# EAGLE design CompIoT (EAGLE 7.4.0)
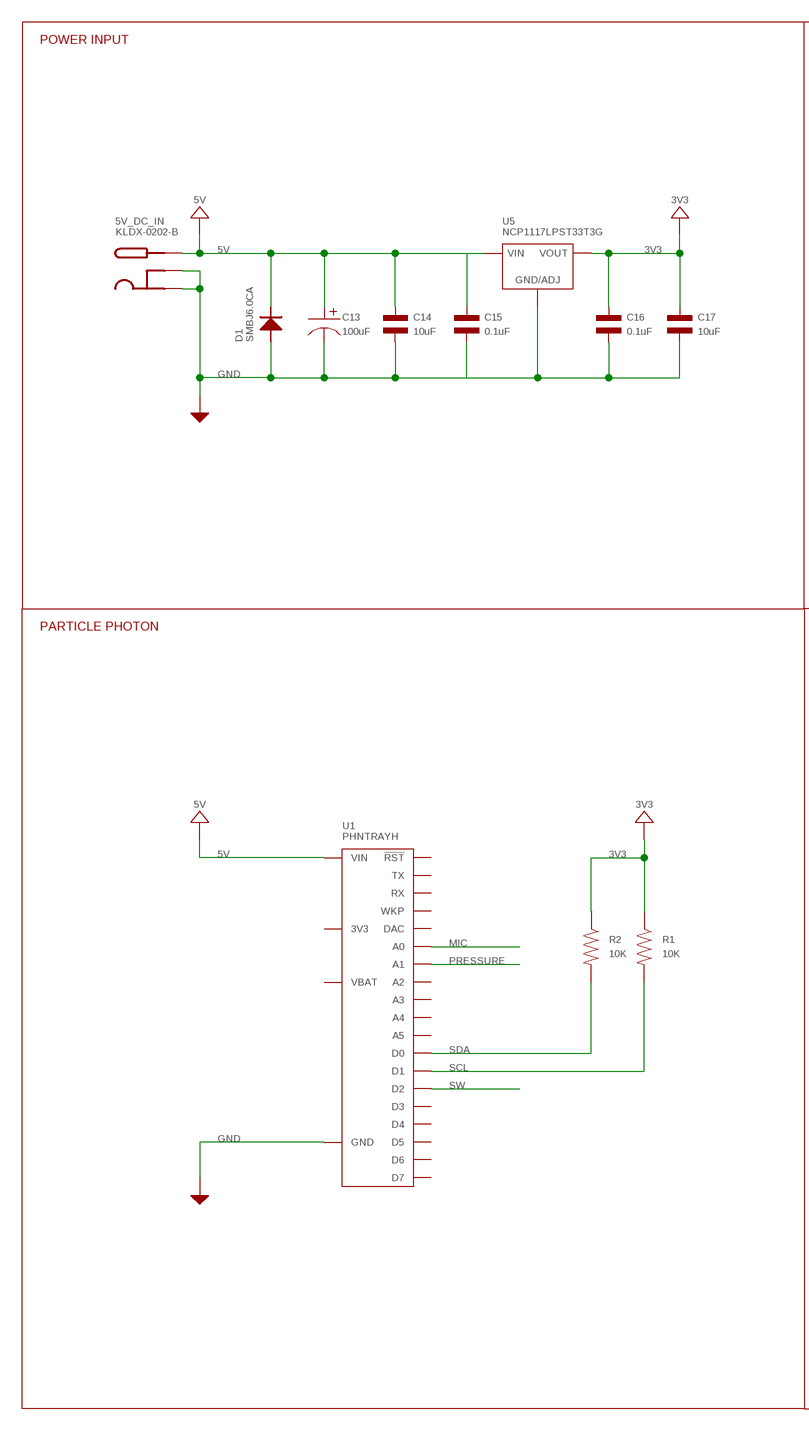
[diagram p0: schematic, sheet 1, part 1 of 2]
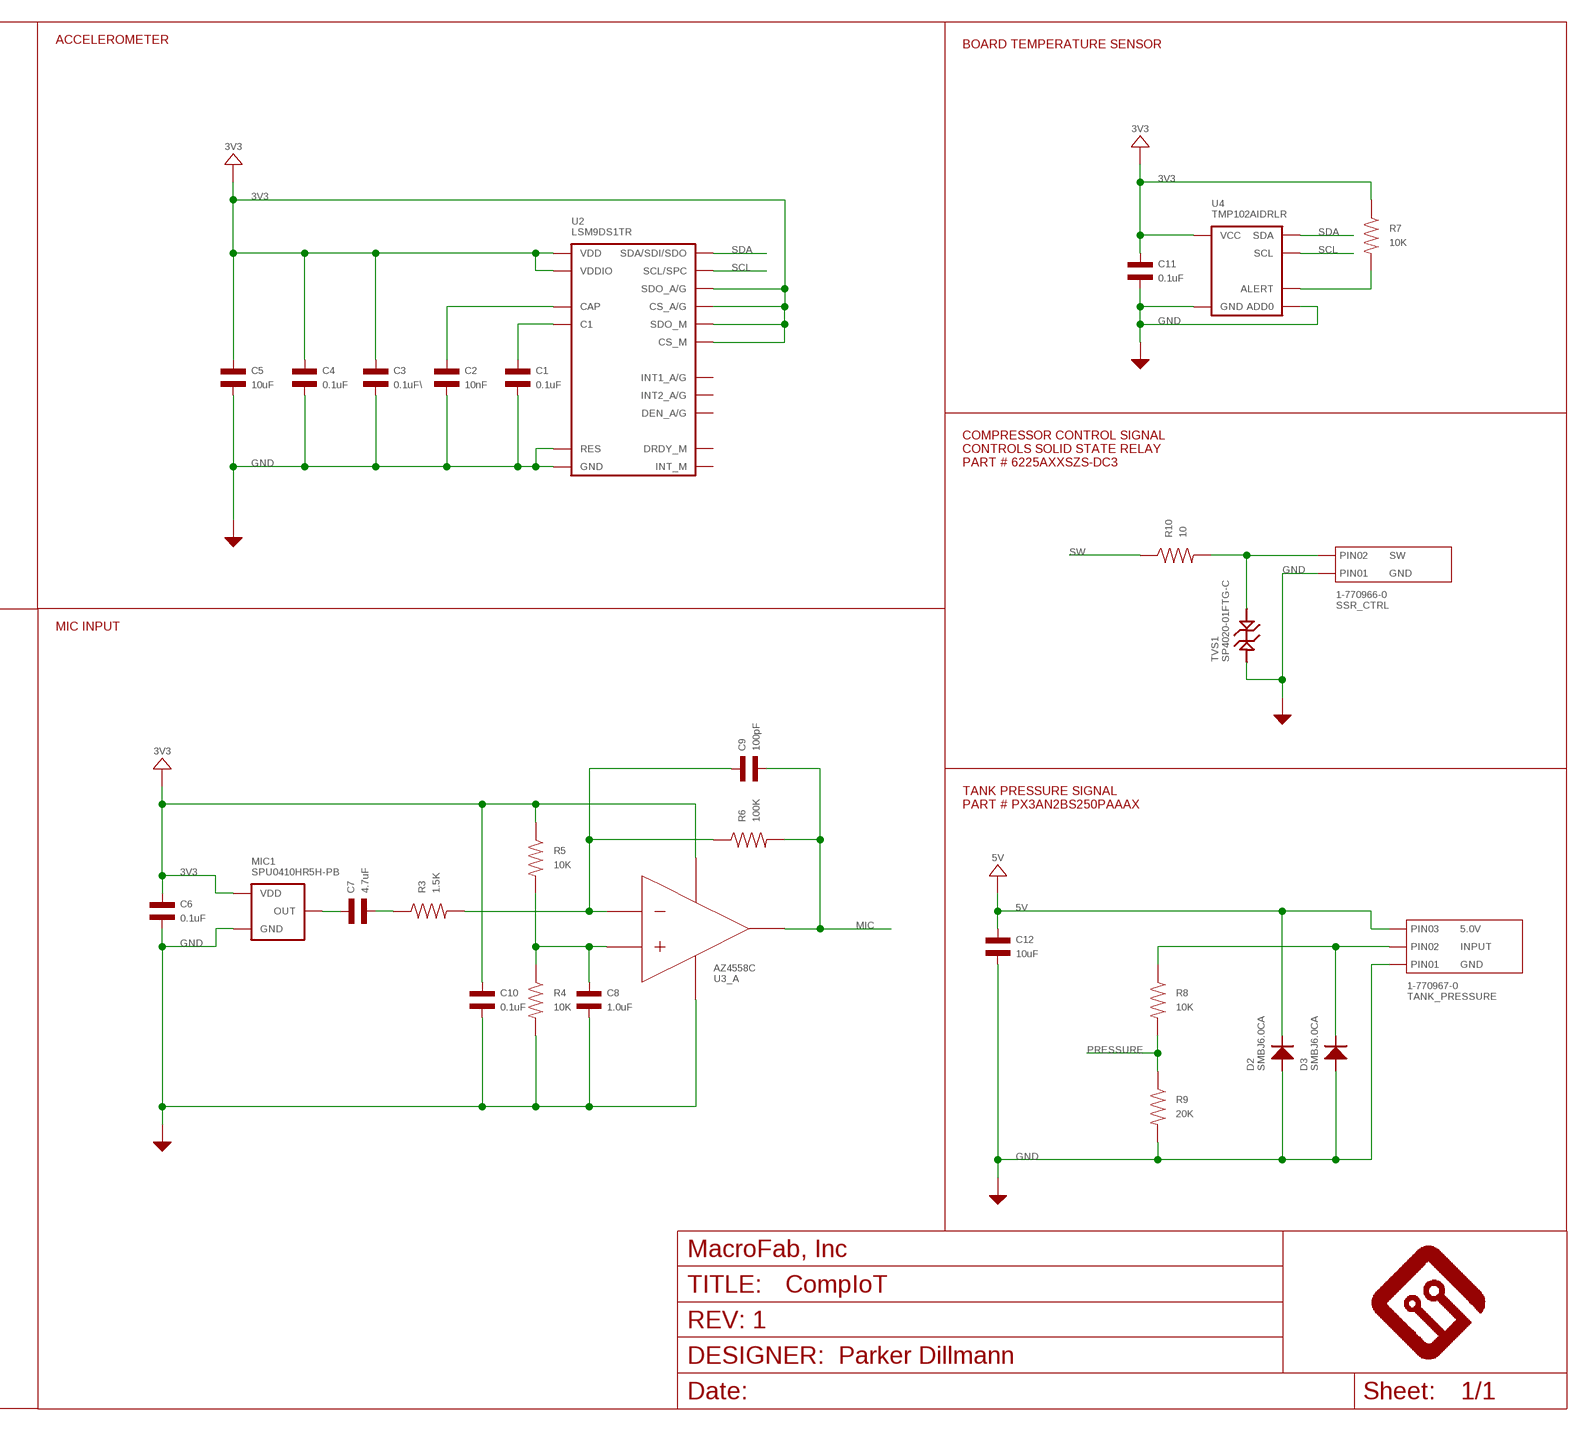
[diagram p1: schematic, sheet 1, part 2 of 2]

## Parts
5V_DC_IN  KLDX-0202-B  DC_PWR_JACK_2.5MM_RIGHT  [DC_PWR_JACK]
C1  0.1uF  CAPACITOR_NP_0603  [C0603]
C2  10nF  CAPACITOR_NP_0603  [C0603]
C3  0.1uF\  CAPACITOR_NP_0603  [C0603]
C4  0.1uF  CAPACITOR_NP_0603  [C0603]
C5  10uF  CAPACITOR_NP_1206  [C1206]
C6  0.1uF  CAPACITOR_NP_0603  [C0603]
C7  4.7uF  CAPACITOR_NP_1206  [C1206]
C8  1.0uF  CAPACITOR_NP_0603  [C0603]
C9  100pF  CAPACITOR_NP_0603  [C0603]
C10  0.1uF  CAPACITOR_NP_0603  [C0603]
C11  0.1uF  CAPACITOR_NP_0603  [C0603]
C12  10uF  CAPACITOR_NP_1206  [C1206]
C13  100uF  CAPACITOR_P_6.3MM  [CP6.3MM]
C14  10uF  CAPACITOR_NP_1206  [C1206]
C15  0.1uF  CAPACITOR_NP_0603  [C0603]
C16  0.1uF  CAPACITOR_NP_0603  [C0603]
C17  10uF  CAPACITOR_NP_1206  [C1206]
D1  SMBJ6.0CA  DIODE_SMBJ  [SMBJ]
D2  SMBJ6.0CA  DIODE_SMBJ  [SMBJ]
D3  SMBJ6.0CA  DIODE_SMBJ  [SMBJ]
FRAME1  MF_FRAMEDEFAULT  [MF_FRAME_DEFAULT]
MIC1  SPU0410HR5H-PB  [SPU0410HR5H-PB]
R1  10K  RESISTOR_0603  [R0603]
R2  10K  RESISTOR_0603  [R0603]
R3  1.5K  RESISTOR_0603  [R0603]
R4  10K  RESISTOR_0603  [R0603]
R5  10K  RESISTOR_0603  [R0603]
R6  100K  RESISTOR_0603  [R0603]
R7  10K  RESISTOR_0603  [R0603]
R8  10K  RESISTOR_0603  [R0603]
R9  20K  RESISTOR_0603  [R0603]
R10  10  RESISTOR_0603  [R0603]
SSR_CTRL  1-770966-0  CON_01X02_1-770966-0  [1-770966-0]
TANK_PRESSURE  1-770967-0  CON_01X03_1-770967-0  [1-770967-0]
TVS1  SP4020-01FTG-C  TVS_DIODE_SOD-323  [SOD-323]
U1  PHNTRAYH  PARTICLE_PHOTON_PTH  [PARTICLE_PHOTON_PTH]
U2  LSM9DS1TR  [LSM9DS1_LGA-24]
U3  AZ4558C  [AZ4558C_SOIC-8]
U4  TMP102AIDRLR  [TMP102_SOT-553-6]
U5  NCP1117LPST33T3G  [SOT-223-3]

## Nets
3V3: C3.P$1 C4.P$1 C5.P$1 C6.P$1 C10.P$1 C11.P$1 C16.P$1 C17.P$1 MIC1.P$1(VDD) R1.P$1 R2.P$1 R5.P$1 R7.P$1 U2.1(VDDIO) U2.3(VDDIO) U2.5(SDO_A/G) U2.6(SDO_M) U2.7(CS_A/G) U2.8(CS_M) U2.22(VDD) U2.23(VDD) U3.4(_A:VEE) U4.5(VCC) U5.P$1(VOUT) U5.P$3(VOUT)
5V: 5V_DC_IN.PIN C12.P$1 C13.P$1 C14.P$1 C15.P$1 D1.CATH(CATHODE) D2.CATH(CATHODE) TANK_PRESSURE.P$3(PIN3) U1.1(VIN) U5.P$4(VIN)
GND: 5V_DC_IN.SLEEVE1(SLEEVE) 5V_DC_IN.SLEEVE2(SLEEVE_SHUNT) C1.P$2 C2.P$2 C3.P$2 C4.P$2 C5.P$2 C6.P$2 C8.P$2 C10.P$2 C11.P$2 C12.P$2 C13.P$2 C14.P$2 C15.P$2 C16.P$2 C17.P$2 D1.ANODE D2.ANODE D3.ANODE MIC1.P$2(GND) MIC1.P$3(GND) R4.P$2 R9.P$2 SSR_CTRL.P$1(PIN1) TANK_PRESSURE.P$1(PIN1) TVS1.ANODE U1.2(GND) U1.21(GND) U2.14(RES) U2.15(RES) U2.16(RES) U2.17(RES) U2.18(RES) U2.19(GND) U2.20(GND) U3.8(_A:VCC) U4.2(GND) U4.4(ADD0) U5.P$2(GND/ADJ)
MIC: C9.P$2 R6.P$2 U1.12(A0) U3.1(_A:OUTPUT_1)
N$1: C1.P$1 U2.24(C1)
N$2: C2.P$1 U2.21(CAP)
N$3: C7.P$1 MIC1.P$4(OUT)
N$4: C7.P$2 R3.P$1
N$5: C9.P$1 R3.P$2 R6.P$1 U3.2(_A:INPUT_1-)
N$6: C8.P$1 R4.P$1 R5.P$2 U3.3(_A:INPUT_1+)
N$7: R7.P$2 U4.3(ALERT)
N$8: R10.P$2 SSR_CTRL.P$2(PIN2) TVS1.CATH
N$9: D3.CATH(CATHODE) R8.P$1 TANK_PRESSURE.P$2(PIN2)
PRESSURE: R8.P$2 R9.P$1 U1.11(A1)
SCL: R1.P$2 U1.14(D1) U2.2(SCL/SPC) U4.1(SCL)
SDA: R2.P$2 U1.13(D0) U2.4(SDA/SDI/SDO) U4.6(SDA)
SW: R10.P$1 U1.15(D2)
Unconnected: U1.3(TX) U1.4(RX) U1.5(WKP) U1.6(DAC) U1.7(A5) U1.8(A4) U1.9(A3) U1.10(A2) U1.16(D3) U1.17(D4) U1.18(D5) U1.19(D6) U1.20(D7) U1.22(VBAT) U1.23(!RST) U1.24(3V3) U2.9(DRDY_M) U2.10(INT_M) U2.11(INT1_A/G) U2.12(INT2_A/G) U2.13(DEN_A/G) U3.5(_B:INPUT_2+) U3.6(_B:INPUT_2-) U3.7(_B:OUTPUT_2)

## Notes on the sheet
- POWER INPUT | ACCELEROMETER | BOARD TEMPERATURE SENSOR
- COMPRESSOR CONTROL SIGNAL
  CONTROLS SOLID STATE RELAY
  PART # 6225AXXSZS-DC3
- PARTICLE PHOTON | MIC INPUT
- TANK PRESSURE SIGNAL
  PART # PX3AN2BS250PAAAX

## Library data of the parts
5V_DC_IN = MF_Connectors:DC_PWR_JACK: Library: MF_Connectors Description: DC Barrel Power Jack Connector.; HOUSEPART: NO; MPN: KLDX-0202-B; POPULATE: 1; URL: http://www.4uconnector.com/online/object/4udrawing/18741.pdf
C1-C12 C14-C17 = MF_Passives:CAPACITOR_NP: Library: MF_Passives Description: Device for Non-Polarized Capacitors. Manufacture part number (MPN) can be added via Attributes. Check https://factory.macrofab.com/parts for the house parts list.; POPULATE: 1
C13 = MF_Passives:CAPACITOR_P: Library: MF_Passives Description: Device for Polarized Capacitors. Manufacture part number (MPN), Voltage Rating, and Tolerance can be added via Attributes. Check https://factory.macrofab.com/parts for the house parts list.; POPULATE: 1
D1-D3 = PP_Passives:DIODE: Diode - Single
FRAME1 = MF_Aesthetics:MF_FRAME: Library: MF_Aesthetics Description: Frame for adding Meta Data to the PCB and Schematic.; DNAME: Parker Dillmann; HOUSEPART: 0; POPULATE: 0; REVNUM: REV: 1
MIC1 = PP_Sensors:SPU0410HR5H-PB
R1-R10 = MF_Passives:RESISTOR: Library: MF_Passives Description: Device for Resistors. Manufacture part number (MPN), Voltage, Tolerance, and Wattage Rating can be added via Attributes. Check https://factory.macrofab.com/parts for the house parts list.; POPULATE: 1
SSR_CTRL = PP_Connectors:CON_01X02; LABEL01: GND; LABEL02: SW
TANK_PRESSURE = PP_Connectors:CON_01X03: 3 pin connectors; LABEL01: GND; LABEL02: INPUT; LABEL03: 5.0V
TVS1 = PP_Passives:TVS_DIODE
U1 = PP_Sensors:PARTICLE_PHOTON
U2 = PP_Sensors:LSM9DS1
U3 = PP_AnalogIC:AZ4558C
U4 = PP_Sensors:TMP102
U5 = MF_IC_Power:NCP1117LP: Manufacturer Part #: NCP1117LP Manufacturer: ON Semiconductor Description: LDO Voltage Regulators; HOUSEPART: NO; MPN: NCP1117LPST33T3G; POPULATE: 1; URL: http://www.onsemi.com/pub_link/Collateral/NCP1117LP-D.PDF

## Board
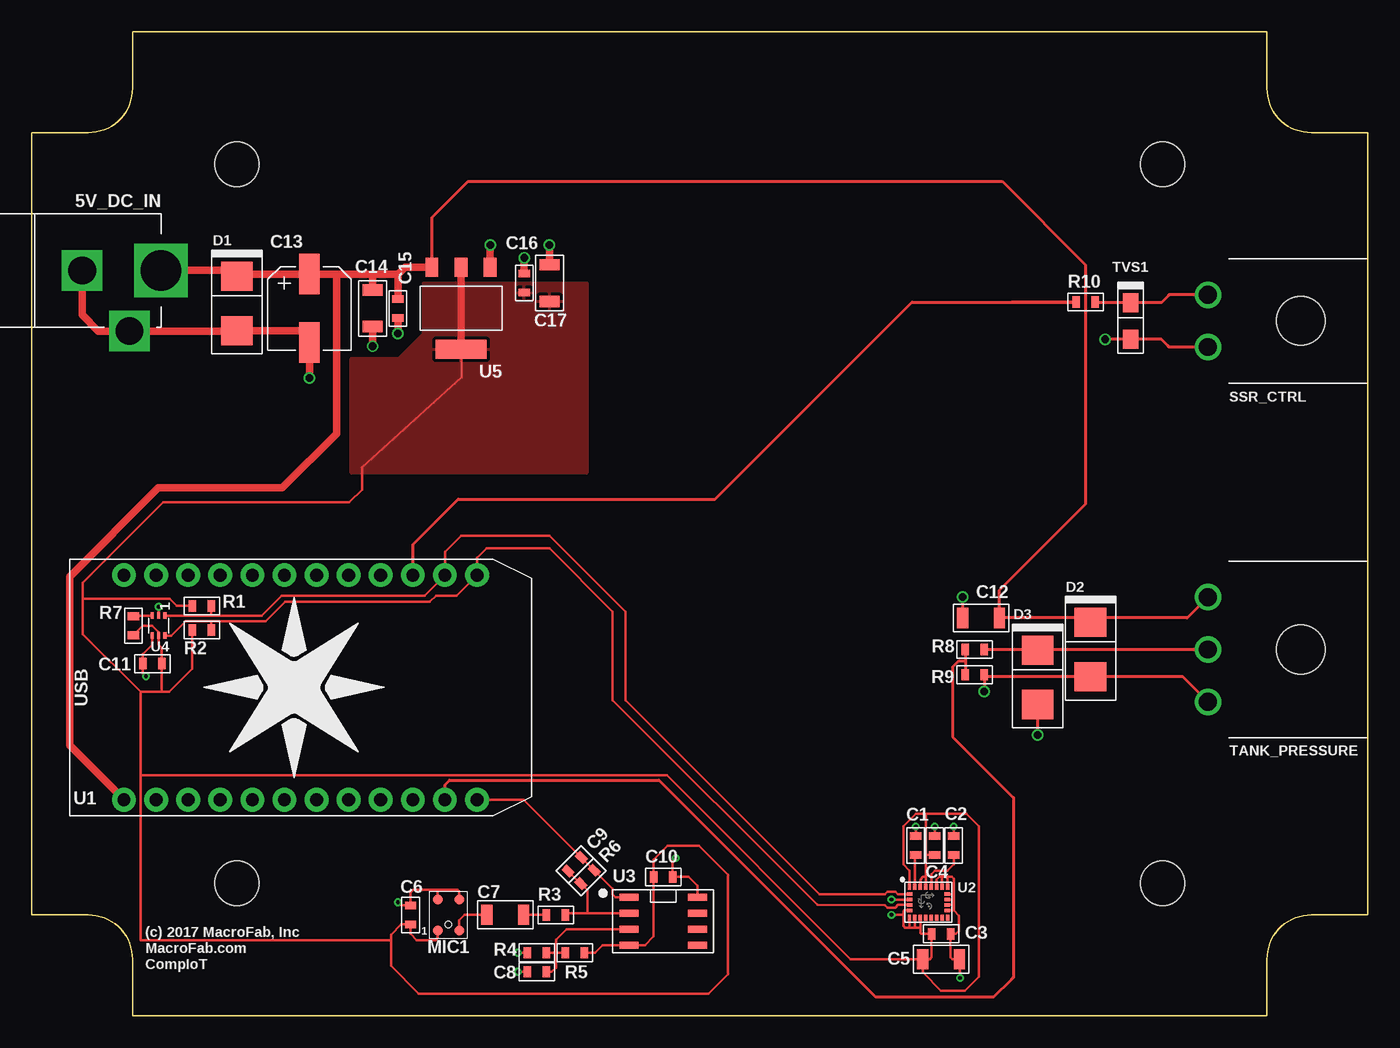
[diagram p2: board, top side]
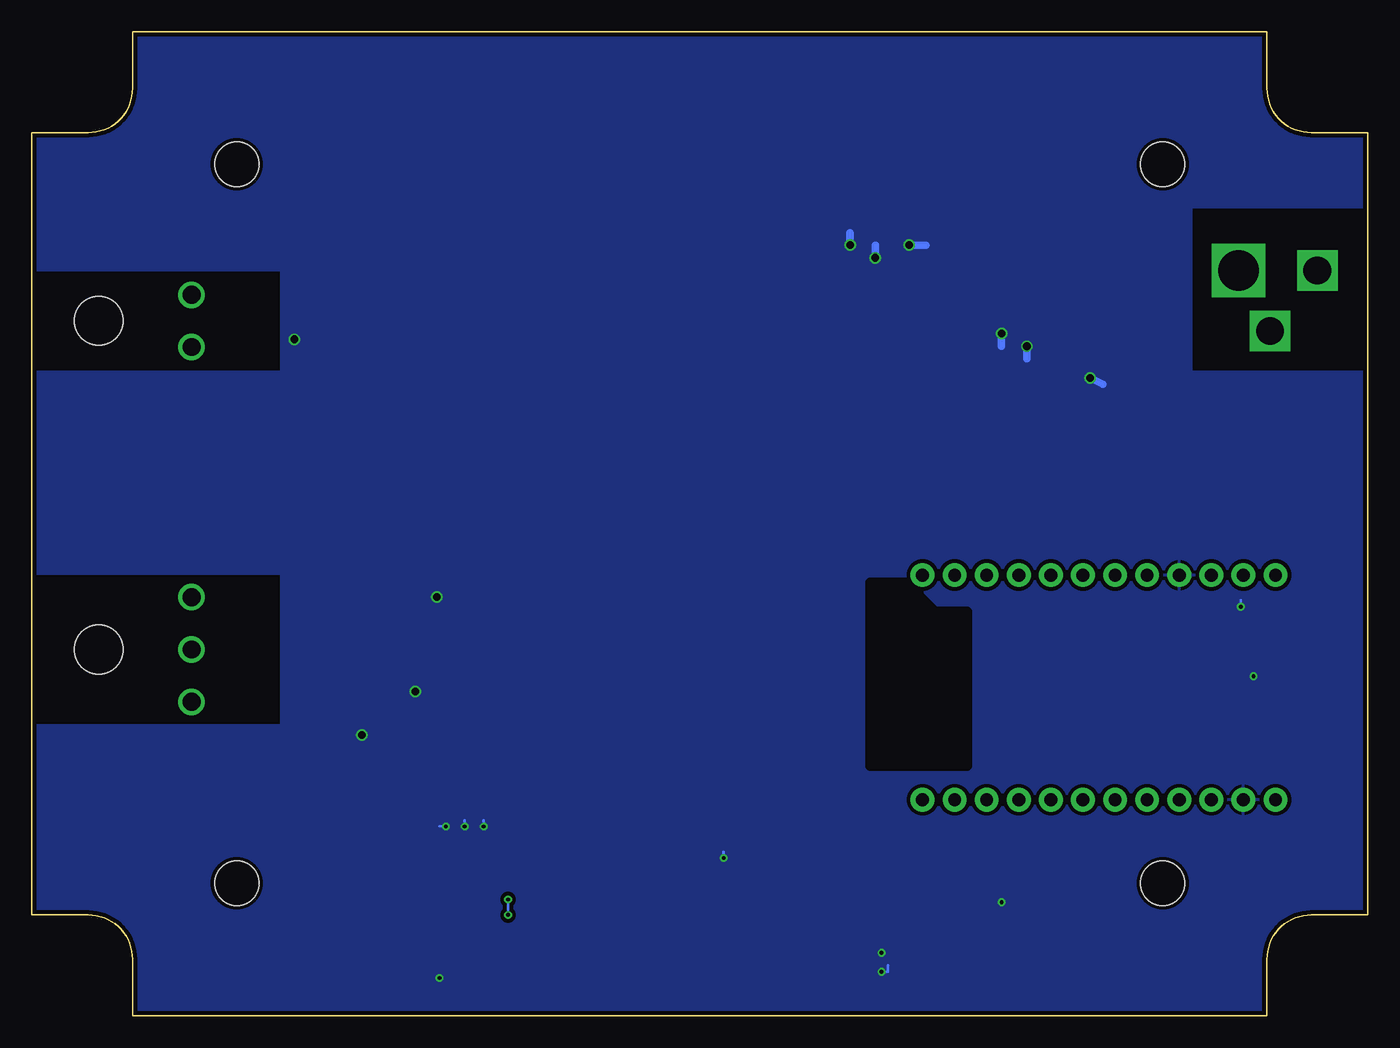
[diagram p3: board, bottom side, seen from below]

Size 105.79 x 77.9 mm. Coordinates in mm from the lower left corner, seen from the top.
Outline: 0,8 4.49,8 arc-90 8,4.49 8,0 97.79,0 97.79,4.49 arc-90 101.3,8 105.79,8 105.79,69.9 101.3,69.9 arc-90 97.79,73.41 97.79,77.9 8,77.9 8,73.41 arc-90 4.49,69.9 0,69.9 0,8
Copper layers (1*16): Top 0.035mm / dielectric 1.5mm / Bottom 0.035mm
Design rules "MF_Standard_2_Layer": minimum track width 5mil, minimum drill 12mil, track to track 5mil, track to pad 5mil, pad to pad 5mil, via to via 5mil, smd to smd 0mil, copper to edge 10mil, drill to drill 10mil, minimum pad ring 6mil, minimum via ring 6mil, stop-mask expansion 2mil, vias tented up to drill 25mil, thermal gap 10mil
Holes 3.51 mm at 16.25,67.4 16.25,10.5 89.55,10.5 89.55,67.4
bRestrict: area 31.8,19.8 to 39.4,34.3

### Footprints (pad centres in the part's own frame; a part is rotated, then mirrored left to right if it is on the bottom)
DC_PWR_JACK = drill 3.2 square: PIN 6.25,0 | drill 2.2 square: SLEEVE1 0,0; SLEEVE2 3.75,-4.8
C0603 = smd 0.6 x 0.9: P$1 -0.75,0; P$2 0.75,0
C1206 = smd 0.9 x 1.6: P$1 -1.45,0; P$2 1.45,0
CP6.3MM = smd 1.6 x 3.2: P$1 0,-2.7; P$2 0,2.7
SMBJ = smd 2.3 x 2.5: ANODE 2.15,0; CATH -2.15,0
SPU0410HR5H-PB = smd 0.8 x 0.8: P$1 0.85,1.23; P$2 0.85,-1.23; P$3 -0.85,-1.23; P$4 -0.85,1.23
R0603 = smd 0.6 x 0.9: P$1 -0.75,0; P$2 0.75,0
1-770966-0 = drill 1.4: P$1 -2.07,12.67; P$2 2.073,12.67 | hole 3.86: 0,5.33
1-770967-0 = drill 1.4: P$1 -4.14,12.67; P$2 0,12.67; P$3 4.14,12.67 | hole 3.86: 0,5.33
SOD-323 = smd 1.5 x 1.2: ANODE 1.45,0; CATH -1.45,0
PARTICLE_PHOTON_PTH = drill 1.016 pad 1.88: 1 -8.89,-4.318; 2 -8.89,-6.858; 3 -8.89,-9.398; 4 -8.89,-11.938; 5 -8.89,-14.478; 6 -8.89,-17.018; 7 -8.89,-19.558; 8 -8.89,-22.098; 9 -8.89,-24.638; 10 -8.89,-27.178; 11 -8.89,-29.718; 12 -8.89,-32.258; 13 8.89,-32.258; 14 8.89,-29.718; 15 8.89,-27.178; 16 8.89,-24.638; 17 8.89,-22.098; 18 8.89,-19.558; 19 8.89,-17.018; 20 8.89,-14.478; 21 8.89,-11.938; 22 8.89,-9.398; 23 8.89,-6.858; 24 8.89,-4.318
LSM9DS1_LGA-24 = smd 0.27 x 0.45: 1 -1.505,1.225; 6 -1.505,-1.225; 7 -1.075,-1.225; 8 -0.645,-1.225; 9 -0.215,-1.225; 10 0.215,-1.225; 11 0.645,-1.225; 12 1.075,-1.225; 13 1.505,-1.225; 18 1.505,1.225; 19 1.075,1.225; 20 0.645,1.225; 21 0.215,1.225; 22 -0.215,1.225; 23 -0.645,1.225; 24 -1.075,1.225 | smd 0.45 x 0.27: 2 -1.475,0.645; 3 -1.475,0.215; 4 -1.475,-0.215; 5 -1.475,-0.645; 14 1.475,-0.645; 15 1.475,-0.215; 16 1.475,0.215; 17 1.475,0.645
AZ4558C_SOIC-8 = smd 1.5 x 0.55: 1 -2.7,1.905; 2 -2.7,0.635; 3 -2.7,-0.635; 4 -2.7,-1.905; 5 2.7,-1.905; 6 2.7,-0.635; 7 2.7,0.635; 8 2.7,1.905
TMP102_SOT-553-6 = smd 0.508 x 0.249: 1 -0.8,0.498; 2 -0.8,0.003; 3 -0.8,-0.506; 4 0.776,-0.506; 5 0.776,0.003; 6 0.776,0.498
SOT-223-3 = smd 1.5 x 4: P$1 3.25,0 | smd 1.5 x 1: P$2 -3.25,2.3; P$3 -3.25,0; P$4 -3.25,-2.3

### Placement (x,y rotation side)
5V_DC_IN  4,59 0 top
C1  70,13.5 90 top
C2  73,13.5 90 top
C3  72,6.5 0 top
C4  71.5,13.5 90 top
C5  72,4.5 0 top
C6  30,8 90 top
C7  37.5,8 0 top
C8  40,3.5 180 top
C9  43,12 45 top
C10  50,11 0 top
C11  9.56,27.88 180 top
C12  75.17,31.5 180 top
C13  22,56 180 top
C14  27,56 270 top
C15  29,56 270 top
C16  39,58 90 top
C17  41,58 90 top
D1  16.26,56.39 270 top
D2  83.82,29 270 top
D3  79.63,26.8 270 top
FRAME1  9,7.5 0 top
MIC1  33,8 180 top
R1  13.47,32.44 0 top
R2  13.47,30.55 0 top
R3  41.5,8 0 top
R4  40,5 180 top
R5  43,5 180 top
R6  44,11 45 top
R7  8.06,30.88 90 top
R8  74.67,29 180 top
R9  74.67,27 0 top
R10  83.44,56.5 0 top
SSR_CTRL  105.79,55 90 top
TANK_PRESSURE  105.79,29 90 top
TVS1  87,55 270 top
U1  3,26 90 top
U2  71,9 0 top
U3  50,7.5 0 top
U4  10.06,30.88 270 top
U5  34,56 270 top

### Tracks (layer width: path | path; a pad name or v marks a point on that pad's centre or on a via)
3V3  (via drill 0.3)
  Top 0.203: U2.8 70.36,7 | 70.36,7 69.92,7 | 69.92,7 69.5,7 | U2.22 70.78,11 | U2.23 70.36,10.79 70.56,11 70.78,11 | U2.1 69.5,11.51 69,12 69,15 70,16 70.78,16 | U2.6 69.5,7 | U2.5 69.09,8.36 69,8.26 69,8 | 69.5,7 69.14,7 69,7.14 69,7.62 69,8 | U2.7 69.92,7 | 70.36,7 70.36,6.6 70.46,6.5 C3.P$1 71.25,4.65 71.1,4.5 C5.P$1 | 70.78,11 70.78,12.75 | 70.78,12.75 70.78,16 | C4.P$1 70.78,12.75 | 70.78,16 74,16 75,15 75,3.12 73.88,2 72,2 70.55,3.45 C5.P$1 | MIC1.P$1 32.15,6.17 31.98,6 30.49,6 30,6.49 C6.P$1 29.27,7.25 28.45,6.43 28.45,6 | R7.P$1 8.81,30.88 9.56,30.88 10.06,30.38 U4.5 10.06,29.38 10.31,29.13 C11.P$1 10.31,25.65 | 8.64,25.65 4.06,30.23 4.06,33.02 | 4.06,33.02 4.06,34.29 10.41,40.64 25.15,40.64 26.16,41.66 26.16,43.43 34.04,50.55 34.04,52.71 U5.P$1 | 28.45,6 8.64,6 8.64,19.05 | 8.64,19.05 8.64,25.65 | R1.P$1 11.5,32.44 10.92,33.02 4.06,33.02 | R2.P$1 12.72,27.47 10.91,25.65 10.31,25.65 | 10.31,25.65 8.64,25.65 | C5.P$1 64.84,4.5 50.29,19.05 8.64,19.05 | 28.45,6 28.45,3.96 30.63,1.78 53.59,1.78 55.12,3.3 55.12,11.18 52.83,13.46 50.35,13.46 49.25,12.37 C10.P$1 49.25,6.29 48.55,5.59 U3.4 45.21,5.59 44.62,5 R5.P$1 | U2.3 v68.07,9.21 | v68.07,8 69,8
  Top 0.61: U5.P$3 U5.P$1
  Bottom 0.203: v68.07,9.21 v68.07,8
  pour Top: 31,58 31,54 29,52 25.27,52 25.27,43 44,43 44,58
5V
  Top 0.254: 83.82,31.5 91.48,31.5 TANK_PRESSURE.P$3 | 83.82,31.5 C12.P$1 76.58,31.54 76.58,33.66 83.44,40.51 83.44,59.44 76.83,66.04 34.54,66.04 31.7,63.2 U5.P$4 | D1.CATH 16.5,58.78 | 16.5,58.78 16.5,59 | 16.5,58.78 16.5,58.7 | D2.CATH 83.82,31.5
  Top 0.61: 5V_DC_IN.PIN 16.5,59 | 16.5,58.7 C13.P$1 24.13,58.7 | 24.13,58.7 27,58.7 | 27,58.7 29,58.7 | C15.P$1 29,58.7 | C14.P$1 27,58.7 | 29,58.7 29.55,59.25 U5.P$4 | U1.1 3,21.43 3,34.77 10.04,41.81 19.85,41.81 24.13,46.09 24.13,58.7
GND  (via drill 0.3, 0.3 pad 0.61, 0.6)
  Top 0.203: C1.P$2 v70,15 | C2.P$2 v73,15 | U2.20 71.64,10.79 71.85,11 72.08,11 | 72.5,11 72.87,11 73,10.87 73,9.64 | 73,9.64 73,9.21 | 73,8.79 73,8.36 | 73,8.36 U2.14 | U2.15 73,8.79 | U2.16 73,9.21 | 73,9.21 73,8.79 | U2.17 73,9.64 | U2.18 72.5,11 | 72.5,11 72.08,11 | U2.19 72.08,11 | C4.P$2 v71.5,15 | v73.5,3 73.5,4.5 C5.P$2 72.92,4.5 72.75,4.67 C3.P$2 73.17,6.5 73.41,6.73 73.41,7.95 73,8.36 | MIC1.P$3 33.85,9.88 33.73,10 32.15,10 | 32.15,10 MIC1.P$2 | 32.15,10 30.25,10 30,9.76 C6.P$2 29.25,8.75 v29,9 | U3.8 52.7,10.3 52,11 C10.P$2 50.75,12.25 v51,12.5 | R4.P$2 v38.5,5 | C8.P$2 v38.5,3.5 | U4.4 9.55,29.37 8.81,28.63 C11.P$2 8.81,27.13 v9.06,26.88 | U4.2 v10.06,32.38
  Top 0.254: TVS1.ANODE 87,53.73 | SSR_CTRL.P$1 90.07,52.93 arc-90 90,53 89.45,53.55 TVS1.ANODE | TVS1.ANODE v85,53.55 | TANK_PRESSURE.P$1 91.13,26.85 D2.ANODE | 84,26.85 D2.ANODE | D2.ANODE 75.42,26.85 | 75.42,26.85 R9.P$2 | 75.42,26.85 v75.42,25.68 | C12.P$2 v73.72,33.17 | D3.ANODE v79.63,22.25
  Top 0.61: 5V_DC_IN.SLEEVE1 4,55.48 5.28,54.2 5V_DC_IN.SLEEVE2 16.26,54.2 | v22,50.5 C13.P$2 22,54.24 D1.ANODE 16.26,54.2 | C14.P$2 v27,53 | C15.P$2 v29,54 | U5.P$2 v36.3,61 | C17.P$2 v41,61 | C16.P$2 v39,60 | 16.5,54.2 16.26,54.2
  Bottom 0.203: v70,15 70,15.5 | v73,15 73.5,15 | v71.5,15 71.5,15.5 | v51,12.5 51,13 | v38.5,3.5 38,3.5 38,4 | v10.06,32.38 10.06,32.88
  Bottom 0.61: v22,50.5 21,50 | v27,53 27,52 | v29,54 29,53 | v36.3,61 35,61 | v41,61 41,62 | v39,60 39,61
  pour Bottom (isolate 0.305, rank 6): 0,0 106,0 106,23 86,23 86,35 106,35 106,51 86,51 86,59 106,59 106,78 0,78 0,64 14,64 14,51 0,51
MIC
  Top 0.203: U1.12 38.95,17.11 C9.P$2 R6.P$2 45.97,10.09 45.97,9.65 46.22,9.4 U3.1
N$1
  Top 0.203: U2.24 69.92,12.75
  Top 0.254: 69.92,12.75 C1.P$1
N$2
  Top 0.203: 73.22,12.75 C2.P$1 73,12 72.5,11.5 71.5,11.5 71.22,11.21 U2.21
N$3
  Top 0.203: MIC1.P$4 33.85,7.58 34.27,8 C7.P$1
N$4
  Top 0.203: C7.P$2 R3.P$1
N$5
  Top 0.203: R3.P$2 42.25,8.13 44,8.13 | 44,8.13 U3.2 | 44,8.13 44,9.94 R6.P$1 C9.P$1
N$6
  Top 0.203: R4.P$1 41.5,5 | 41.5,5 R5.P$2 | U3.3 42.34,6.87 41.5,6.03 41.5,5 | C8.P$1 41.17,3.5 41.5,3.83 41.5,5
N$7
  Top 0.203: R7.P$2 8.11,31.68 U4.3
N$8
  Top 0.254: 87,56.27 TVS1.CATH | TVS1.CATH 84.25,56.45 R10.P$2 | SSR_CTRL.P$2 90.07,57.07 arc90 90,57 89.45,56.45 TVS1.CATH
N$9
  Top 0.254: TANK_PRESSURE.P$2 79.5,29 R8.P$1
  Top 0.61: D3.CATH 79.5,28.95 79.5,29
PRESSURE
  Top 0.254: R8.P$2 73.92,28.07 | 73.92,28.07 R9.P$1 | U1.11 32.72,18.29 33.09,18.66 49.66,18.66 66.8,1.52 76.2,1.52 77.6,2.92 77.72,3.05 77.72,17.27 72.9,22.1 72.9,27.61 73.36,28.07 73.92,28.07
SCL
  Top 0.203: U2.2 68.59,9.64 68.4,9.83 67.74,9.83 67.56,9.65 62.35,9.64 47,25 47,32 41,38 34,38 32.72,36.72 U1.14 31.1,33.27 19.81,33.27 18.22,31.68 14.22,31.68 | U4.1 14.22,31.68 | R1.P$2 14.22,31.68
SDA
  Top 0.203: U2.4 68.6,8.79 68.39,8.58 67.75,8.58 67.56,8.76 62.22,8.79 46,25 46,32 41,37 36,37 35.26,36.26 U1.13 33.64,33.27 32,33.27 31.5,32.77 20.07,32.77 18.54,31.24 14.22,31.24 | U4.6 11.05,30.1 12.19,31.24 14.22,31.24 | R2.P$2 14.22,31.24
SW
  Top 0.254: 77.58,56.5 R10.P$1 69.71,56.5 54.1,40.89 33.78,40.89 30.18,37.29 U1.15